# Altium schematic sheet Sensor.SchDoc
size A4; SheetNumber: 5; SheetTotal: 5
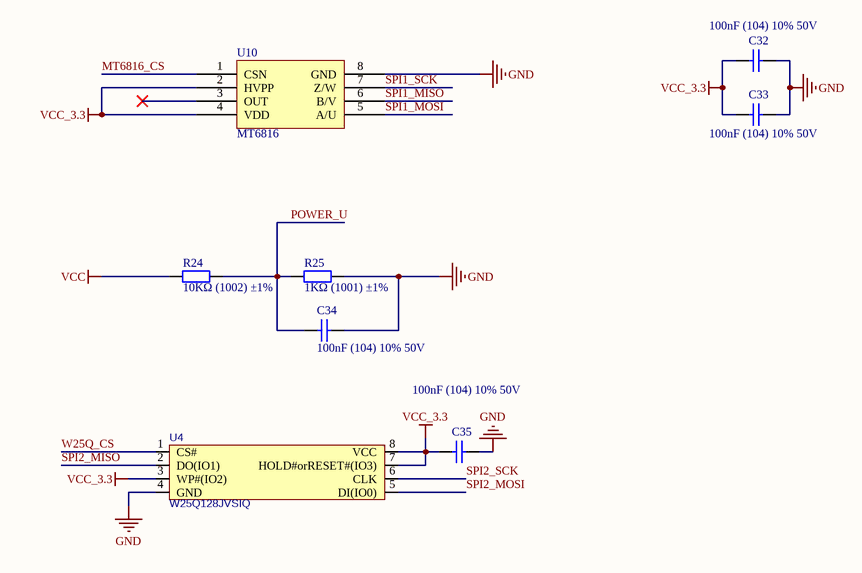
[diagram p0: Sensor.SchDoc]

## Parts
C32  100nF (104) 10% 50V  [0603_C]
C33  100nF (104) 10% 50V  [0603_C]
C34  100nF (104) 10% 50V  [0603_C]
C35  100nF (104) 10% 50V  [0603_C]
R24  10KΩ (1002) ±1%  [0603_R]
R25  1KΩ (1001) ±1%  [0603_R]
U4  W25Q128JVSIQ  [SOIC-8W]
U10  MT6816  [SOIC_8]

## Nets
GND: C32.1 C33.1 C34.2 C35.2 R25.2 U4.4(GND) U10.8(GND)
VCC: R24.1
VCC_3.3: C32.2 C33.2 C35.1 U4.3(WP#(IO2)) U4.7(HOLD#orRESET#(IO3)) U4.8(VCC) U10.2(HVPP) U10.4(VDD)
MT6816_CS: U10.1(CSN)
POWER_U: C34.1 R24.2 R25.1
SPI1_MISO: U10.6(B/V)
SPI1_MOSI: U10.5(A/U)
SPI1_SCK: U10.7(Z/W)
SPI2_MISO: U4.2(DO(IO1))
SPI2_MOSI: U4.5(DI(IO0))
SPI2_SCK: U4.6(CLK)
W25Q_CS: U4.1(CS#)

Not connected (* = marked no-connect by the designer): U10 3(OUT)*

## Library data of the parts
C32-C35 = 0603 100nF (104) 10% 50V: 贴片电容; ComponentLink1Description: 供应商链接; ComponentLink1URL: http://www.szlcsc.com/product/details_15331.html; Package: 0603; Supplier: LC; SuppliersPartNumber: C14663
R24 = 0603 10KΩ (1002) 1%: 贴片电阻; ComponentLink1Description: 供应商链接; ComponentLink1URL: http://www.szlcsc.com/product/details_26547.html; Package: 0603; Supplier: LC; SuppliersPartNumber: C25804
R25 = 0603 1KΩ (1001) 1%: 贴片电阻; ComponentLink1Description: 供应商链接; ComponentLink1URL: http://www.szlcsc.com/product/details_21904.html; Package: 0603; Supplier: LC; SuppliersPartNumber: C21190
U4 = W25Q128: SPI FLASH; 1.库作者: 冰凌猫; 2.库版本: v2.0 (2021.03.30); 3.交流分享: Q群514746572,开源更新,欢迎一起交流学习PCB设计; 4.作者声明: 旨为整合最全库集,欢迎转载,禁止商用！-冰凌猫; 5.备注说明: 该库已二次整合过网上各热销库,基本最全,无需重复搜购安装
U10 = MT6816: 磁角度传感器